# Altium schematic sheet CT9042 Toplevel.SchDoc
size B; SheetNumber: 1; SheetTotal: 9
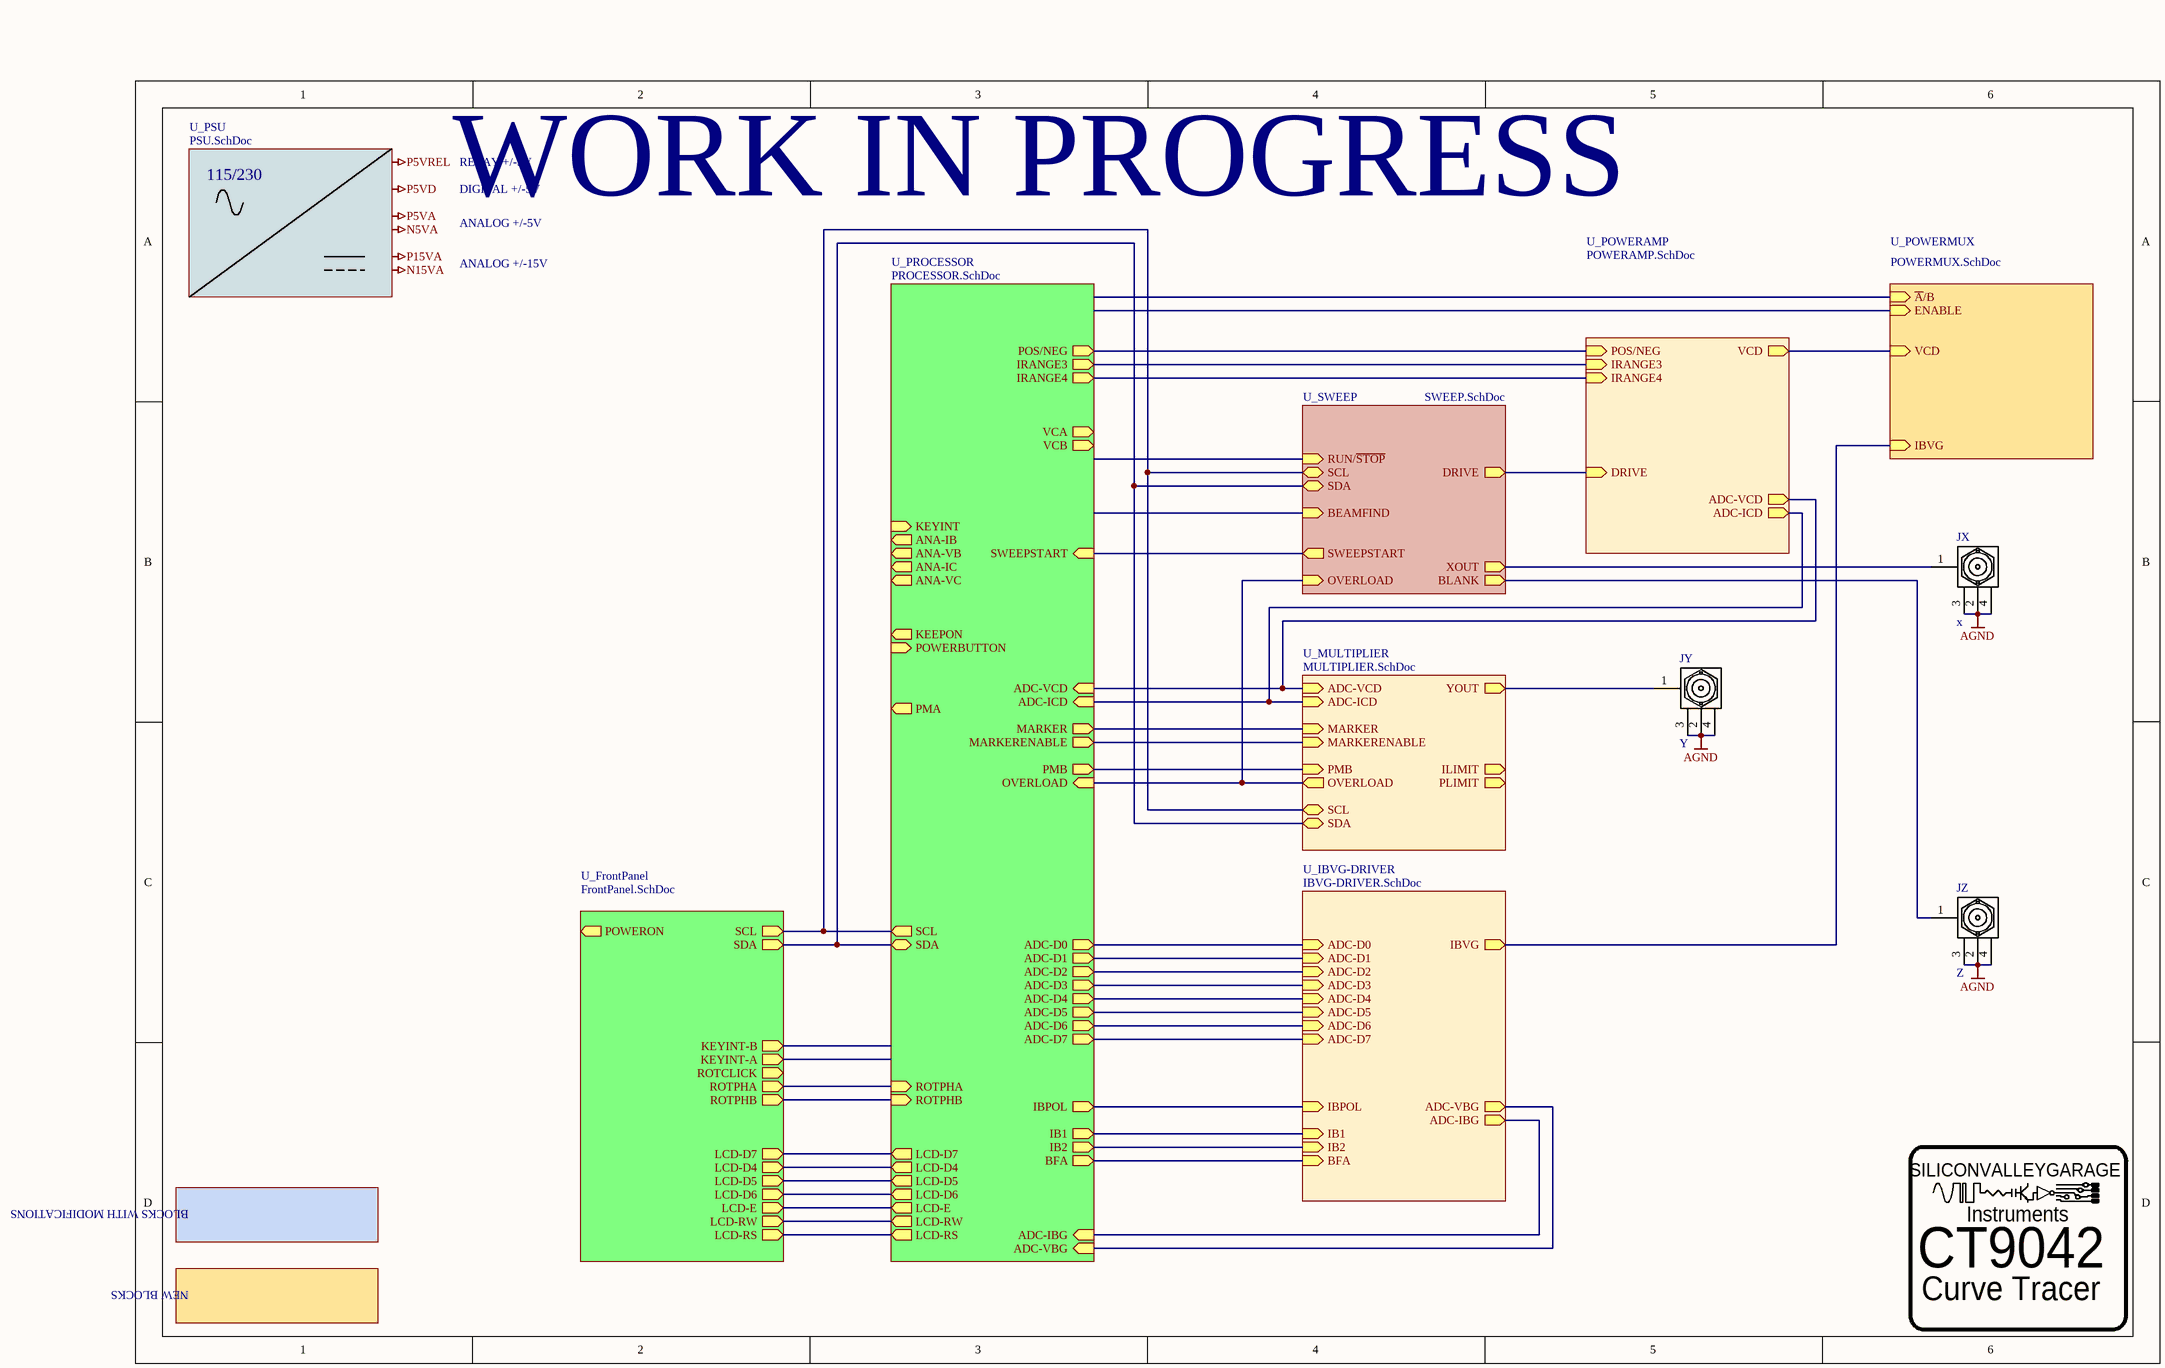
[diagram p0: CT9042 Toplevel.SchDoc]

## Parts
JX  x  [CONN-BNC-RA-TE-CONBNC002]
JY  Y  [CONN-BNC-RA-TE-CONBNC002]
JZ  Z  [CONN-BNC-RA-TE-CONBNC002]
LOGO?  LOGO-SILICONVALLEYGARAGE-SMALL  [SILICONVALLEYGARAGE]  (value not drawn)  (graphical)

## Blocks framed on the sheet
CT9042: LOGO?

## Sub-sheets
U_FrontPanel = FrontPanel.SchDoc: SCL (out), SDA (out), ROTCLICK (out), ROTPHA (out), ROTPHB (out), LCD-D7 (out), LCD-D4 (out), LCD-D5 (out), LCD-D6 (out), LCD-E (out), LCD-RW (out), LCD-RS (out), POWERON (out), KEYINT-B (out), KEYINT-A (out)
U_IBVG-DRIVER = IBVG-DRIVER.SchDoc: BFA (in), IB2 (in), IB1 (in), ADC-D0 (in), ADC-D1 (in), ADC-D2 (in), ADC-D3 (in), ADC-D4 (in), ADC-D5 (in), ADC-D6 (in), ADC-D7 (in), ADC-VBG (out), ADC-IBG (out), IBPOL (in), IBVG (out)
U_MULTIPLIER = MULTIPLIER.SchDoc: PMB (in), OVERLOAD (out), ADC-VCD (in), ADC-ICD (in), MARKER (in), YOUT (out), SCL (bidir), SDA (bidir), MARKERENABLE (in), ILIMIT (out), PLIMIT (out)
U_POWERAMP = POWERAMP.SchDoc: ADC-ICD (out), DRIVE (in), ADC-VCD (out), VCD (out), POS/NEG (in), IRANGE3 (in), IRANGE4 (in)
U_POWERMUX = POWERMUX.SchDoc: VCD (in), IBVG (in), ~{A}/B (in), ENABLE (in)
U_PROCESSOR = PROCESSOR.SchDoc: ADC-D0 (out), ADC-D1 (out), ADC-D2 (out), ADC-D3 (out), ADC-D4 (out), ADC-D5 (out), ADC-D6 (out), ADC-D7 (out), VCA (out), VCB (out), BFA (out), IB2 (out), IB1 (out), IBPOL (out), PMA (out), PMB (out), SCL (out), SDA (bidir), ROTPHA (in), ROTPHB (in), ADC-VBG (in), ADC-IBG (in), ADC-VCD (in), ADC-ICD (in), OVERLOAD (in), LCD-D7 (out), LCD-D4 (out), LCD-D5 (out), LCD-D6 (out), LCD-E (out), LCD-RW (out), LCD-RS (out), KEYINT (in), ANA-IB (out), ANA-VB (out), ANA-IC (out), ANA-VC (out), SWEEPSTART (in), MARKER (out), MARKERENABLE (out), KEEPON (out), POWERBUTTON (in), IRANGE3 (out), IRANGE4 (out), POS/NEG (out)
U_PSU = PSU.SchDoc: no entries
U_SWEEP = SWEEP.SchDoc: DRIVE (out), SWEEPSTART (out), XOUT (out), RUN/~{STOP} (in), SCL (bidir), SDA (bidir), BLANK (out), BEAMFIND (in), OVERLOAD (in)

## Nets
AGND: JX.2 JX.3 JX.4 JY.2 JY.3 JY.4 JZ.2 JZ.3 JZ.4
NetJX_1: JX.1 ; sheet U_SWEEP/XOUT
NetJY_1: JY.1 ; sheet U_MULTIPLIER/YOUT
NetJZ_1: JZ.1 ; sheet U_SWEEP/BLANK
(unnamed): sheet U_POWERAMP/ADC-ICD, sheet U_MULTIPLIER/ADC-ICD, sheet U_PROCESSOR/ADC-ICD
(unnamed): sheet U_POWERAMP/DRIVE, sheet U_SWEEP/DRIVE
(unnamed): sheet U_POWERAMP/ADC-VCD, sheet U_MULTIPLIER/ADC-VCD, sheet U_PROCESSOR/ADC-VCD
(unnamed): sheet U_POWERAMP/VCD, sheet U_POWERMUX/VCD
(unnamed): sheet U_POWERAMP/POS/NEG, sheet U_PROCESSOR/POS/NEG
(unnamed): sheet U_POWERAMP/IRANGE3, sheet U_PROCESSOR/IRANGE3
(unnamed): sheet U_POWERAMP/IRANGE4, sheet U_PROCESSOR/IRANGE4
(unnamed): sheet U_IBVG-DRIVER/BFA, sheet U_PROCESSOR/BFA
(unnamed): sheet U_IBVG-DRIVER/IB2, sheet U_PROCESSOR/IB2
(unnamed): sheet U_IBVG-DRIVER/IB1, sheet U_PROCESSOR/IB1
(unnamed): sheet U_IBVG-DRIVER/ADC-D0, sheet U_PROCESSOR/ADC-D0
(unnamed): sheet U_IBVG-DRIVER/ADC-D1, sheet U_PROCESSOR/ADC-D1
(unnamed): sheet U_IBVG-DRIVER/ADC-D2, sheet U_PROCESSOR/ADC-D2
(unnamed): sheet U_IBVG-DRIVER/ADC-D3, sheet U_PROCESSOR/ADC-D3
(unnamed): sheet U_IBVG-DRIVER/ADC-D4, sheet U_PROCESSOR/ADC-D4
(unnamed): sheet U_IBVG-DRIVER/ADC-D5, sheet U_PROCESSOR/ADC-D5
(unnamed): sheet U_IBVG-DRIVER/ADC-D6, sheet U_PROCESSOR/ADC-D6
(unnamed): sheet U_IBVG-DRIVER/ADC-D7, sheet U_PROCESSOR/ADC-D7
(unnamed): sheet U_IBVG-DRIVER/ADC-VBG, sheet U_PROCESSOR/ADC-VBG
(unnamed): sheet U_IBVG-DRIVER/ADC-IBG, sheet U_PROCESSOR/ADC-IBG
(unnamed): sheet U_IBVG-DRIVER/IBPOL, sheet U_PROCESSOR/IBPOL
(unnamed): sheet U_IBVG-DRIVER/IBVG, sheet U_POWERMUX/IBVG
(unnamed): sheet U_SWEEP/SWEEPSTART, sheet U_PROCESSOR/SWEEPSTART
(unnamed): sheet U_SWEEP/SCL, sheet U_MULTIPLIER/SCL, sheet U_FrontPanel/SCL, sheet U_PROCESSOR/SCL
(unnamed): sheet U_SWEEP/SDA, sheet U_MULTIPLIER/SDA, sheet U_FrontPanel/SDA, sheet U_PROCESSOR/SDA
(unnamed): sheet U_SWEEP/OVERLOAD, sheet U_MULTIPLIER/OVERLOAD, sheet U_PROCESSOR/OVERLOAD
(unnamed): sheet U_MULTIPLIER/PMB, sheet U_PROCESSOR/PMB
(unnamed): sheet U_MULTIPLIER/MARKER, sheet U_PROCESSOR/MARKER
(unnamed): sheet U_MULTIPLIER/MARKERENABLE, sheet U_PROCESSOR/MARKERENABLE
(unnamed): sheet U_FrontPanel/ROTPHA, sheet U_PROCESSOR/ROTPHA
(unnamed): sheet U_FrontPanel/ROTPHB, sheet U_PROCESSOR/ROTPHB
(unnamed): sheet U_FrontPanel/LCD-D7, sheet U_PROCESSOR/LCD-D7
(unnamed): sheet U_FrontPanel/LCD-D4, sheet U_PROCESSOR/LCD-D4
(unnamed): sheet U_FrontPanel/LCD-D5, sheet U_PROCESSOR/LCD-D5
(unnamed): sheet U_FrontPanel/LCD-D6, sheet U_PROCESSOR/LCD-D6
(unnamed): sheet U_FrontPanel/LCD-E, sheet U_PROCESSOR/LCD-E
(unnamed): sheet U_FrontPanel/LCD-RW, sheet U_PROCESSOR/LCD-RW
(unnamed): sheet U_FrontPanel/LCD-RS, sheet U_PROCESSOR/LCD-RS

## Notes on the sheet
- 115/230
- RELAY +/-5V
- WORK IN PROGRESS
- ANALOG +/-5V
- DIGITAL +/-5V
- ANALOG +/-15V
- BLOCKS WITH MODIFICATIONS
- (near LOGO?) Instruments
- NEW BLOCKS
- Curve Tracer
- Labels drawn without touching a wire or pin: N5VA, N15VA, P5VA, P5VD, P5VREL, P15VA
- (in symbol LOGO-SILICONVALLEYGARAGE-SMALL) SILICONVALLEYGARAGE

## Library data of the parts
JX JY JZ = CONN-BNC-RA-TE-CONBNC002
LOGO? = LOGO-SILICONVALLEYGARAGE-SMALL: LOGO,SILICONVALLEYGARAGE,SMALL